# Altium schematic sheet Sheet4_LCD_Interface.SchDoc: =ProjectName
size A4; DocumentNumber: 4; SheetNumber: 4; SheetTotal: 4
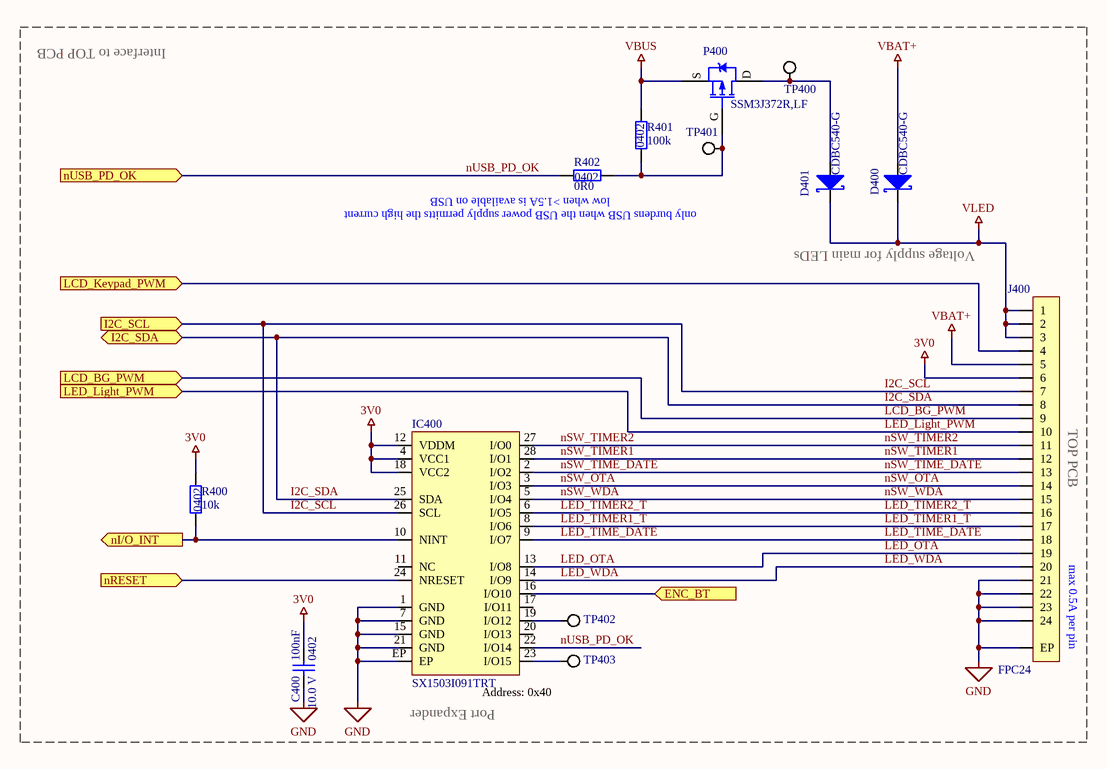
[diagram p0: Sheet4_LCD_Interface.SchDoc]

## Parts
C400  Capacitance: 100nF  Footprint: 0402  Voltage: 10.0 V  [C_0402]  (hidden comment: C 100nF 0402 10V)
D400  Manufacturer Part Number: CDBC540-G  [DO-214AB]  (hidden comment: D SCH 40V 5A)
D401  Manufacturer Part Number: CDBC540-G  [DO-214AB]  (hidden comment: D SCH 40V 5A)
IC400  SX1503I091TRT  [UFQFN-28-EP]
J400  FPC24  [J_FPC_522712479]
P400  Manufacturer Part Number: SSM3J372R,LF  [SOT-23-3-F]  (hidden comment: P PMOS 30V 6A)
R400  Resistance: 10k  Footprint: 0402  [R_0402]  (hidden comment: R 10k 0402)
R401  Resistance: 100k  Footprint: 0402  [R_0402]  (hidden comment: R 1k8 0402)
R402  Resistance: 0R0  Footprint: 0402  [R_0402]  (hidden comment: R 0R0 0402)
TP400  TP  [TP_1mm]  (value not drawn)  (net tie, no BOM)
TP401  TP  [TP_1mm]  (value not drawn)  (net tie, no BOM)
TP402  TP  [TP_1mm]  (value not drawn)  (net tie, no BOM)
TP403  TP  [TP_1mm]  (value not drawn)  (net tie, no BOM)

## Ports
ENC_BT (in), I2C_SCL (in), I2C_SDA (bidir), LCD_BG_PWM (in), LCD_Keypad_PWM (in), LED_Light_PWM (in), nI/O_INT (out), nRESET (in), nUSB_PD_OK (in)

## Nets
3V0: C400.2 IC400.4(VCC1) IC400.12(VDDM) IC400.18(VCC2) J400.6 R400.2
GND: C400.1 IC400.1(GND) IC400.7(GND) IC400.15(GND) IC400.21(GND) IC400.EP J400.21 J400.22 J400.23 J400.24 J400.EP
VBAT+: D400.2(A) J400.5
VBUS: P400.2(S) R401.2
VLED: D400.1(K) D401.1(K) J400.1 J400.2 J400.3
ENC_BT: IC400.16(I/O10) ; port ENC_BT
I2C_SCL: IC400.26(SCL) J400.7 ; port I2C_SCL
I2C_SDA: IC400.25(SDA) J400.8 ; port I2C_SDA
LCD_BG_PWM: J400.9 ; port LCD_BG_PWM
LCD_Keypad_PWM: J400.4 ; port LCD_Keypad_PWM
LED_Light_PWM: J400.10 ; port LED_Light_PWM
LED_OTA: IC400.13(I/O8) J400.19
LED_TIME_DATE: IC400.9(I/O7) J400.18
LED_TIMER1_T: IC400.8(I/O6) J400.17
LED_TIMER2_T: IC400.6(I/O5) J400.16
LED_WDA: IC400.14(I/O9) J400.20
nI/O_INT: IC400.10(NINT) R400.1 ; port nI/O_INT
nRESET: IC400.24(NRESET) ; port nRESET
nSW_OTA: IC400.3(I/O3) J400.14
nSW_TIME_DATE: IC400.2(I/O2) J400.13
nSW_TIMER1: IC400.28(I/O1) J400.12
nSW_TIMER2: IC400.27(I/O0) J400.11
nSW_WDA: IC400.5(I/O4) J400.15
nUSB_PD_OK: IC400.22(I/O14) R402.2 ; port nUSB_PD_OK
NetD401_2: D401.2(A) P400.3(D) TP400.1(TP)
NetIC400_19: IC400.19(I/O12) TP402.1(TP)
NetIC400_23: IC400.23(I/O15) TP403.1(TP)
NetP400_1: P400.1(G) R401.1 R402.1 TP401.1(TP)

Not connected (* = marked no-connect by the designer): IC400 11(NC) 17(I/O11) 20(I/O13)

## Notes on the sheet
- Interface to TOP PCB
- (near R402) low when >1.5A is available on USB
- (near R402) only burdens USB when the USB power supply permitts the high current
- Voltage supply for main LEDs
- (near J400) TOP PCB
- (near J400) max 0.5A per pin
- (near IC400) Port Expander
- (near IC400) Address: 0x40
- Title
- Size:
- Date:
- A4
- Number:
- Time:
- Revision:
- Sheet
- of
- File:

## Library data of the parts
C400 = CAP_100nF_10V_0402: CAP CER 0.1UF 10V X5R 0402; Manufacturer: Samsung Electro-Mechanics; Manufacturer Part Number: CL05A104MP5NNNC; Type: Capacitor; Supplier 1: Digi-Key; Supplier Part Number 1: 1276-1443-1-ND
D400 D401 = D_SCH_40V_5A: DIODE SCHOTTKY 40V 5A DO214AB; Manufacturer: Comchip Technology; Type: Diode; Supplier 1: Digi-Key; Supplier Part Number 1: 641-1126-1-ND
IC400 = IC_16ch_Port_Extender_2: IC GPIO EXPANDER I2C 16CH 28-QFN; Manufacturer: Semtech Corporation; Manufacturer Part Number: SX1503I091TRT; Type: IC, Driver; Supplier 1: Digi-Key; Supplier Part Number 1: SX1503I091CT-ND
J400 = J_FPC24_DS: CONN FPC BOT 24 PIN 1mm Pitch; Manufacturer: MOLEX; Manufacturer Part Number: 522712479; Pitch: 1.0; Type: Connector; Supplier 1: LCSC; Supplier Part Number 1: C293627; Pins: 24
P400 = P_PCH_30V_1W: MOSFET P-CH 30V 6A SOT23F; Manufacturer: Toshiba Semiconductor and Storage; Type: Transistor; Supplier 1: Digi-Key; Supplier Part Number 1: SSM3J372RLFCT-ND
R400 = R_10k_0402: RES 10K OHM 1% 1/16W 0402; Manufacturer: YAGEO; Manufacturer Part Number: RC0402FR-0710KL; Type: Resistor; Supplier 1: Digi-Key; Supplier Part Number 1: 311-10.0KLRCT-ND
R401 = R_100k_0402: RES 100K OHM 5% 1/16W 0402; Manufacturer: YAGEO; Manufacturer Part Number: RC0402JR-07100KL; Type: Resistor; Supplier 1: Digi-Key; Supplier Part Number 1: 311-100KJRCT-ND
R402 = R_0R0_0402: RES 0 OHM JUMPER 1/16W 0402; Manufacturer: Stackpole Electronics Inc; Manufacturer Part Number: RMCF0402ZT0R00; Type: Resistor; Supplier 1: Digi-Key; Supplier Part Number 1: RMCF0402ZT0R00CT-ND
TP400-TP403 = TP_1mm: Test Point 1mm